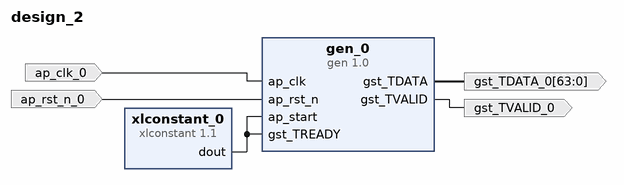
[diagram p0: block diagram of the top level]
# Vivado block design design_2, xc7z020clg484-1, Vivado 2022.2.2
create_bd_design design_2

create_bd_port -dir I -type clk ap_clk_0
create_bd_port -dir I -type rst ap_rst_n_0
create_bd_port -dir O -from 63 -to 0 gst_TDATA_0
create_bd_port -dir O gst_TVALID_0

create_bd_cell -type ip -vlnv xilinx.com:hls:gen:1.0 gen_0
create_bd_cell -type ip -vlnv xilinx.com:ip:xlconstant:1.1 xlconstant_0

# ---- connections ----

connect_bd_net -net ap_clk_0_1 [get_bd_ports ap_clk_0] [get_bd_pins gen_0/ap_clk]
connect_bd_net -net ap_rst_n_0_1 [get_bd_ports ap_rst_n_0] [get_bd_pins gen_0/ap_rst_n]
connect_bd_net [get_bd_pins gen_0/gst_TDATA] [get_bd_ports gst_TDATA_0]
connect_bd_net [get_bd_pins gen_0/gst_TVALID] [get_bd_ports gst_TVALID_0]
connect_bd_net [get_bd_pins xlconstant_0/dout] [get_bd_pins gen_0/ap_start] [get_bd_pins gen_0/gst_TREADY]

validate_bd_design
save_bd_design
